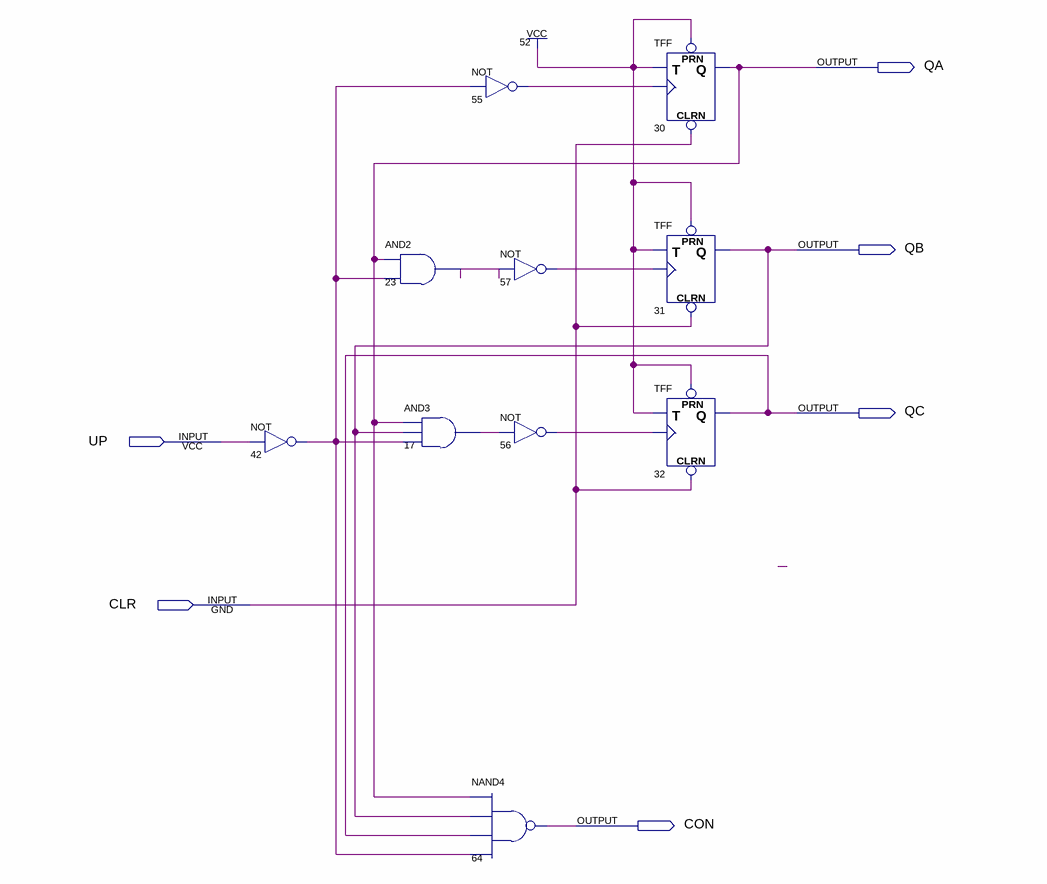
[diagram p0: schematic sheet]
// Quartus schematic count8new10sept.bdf as structural Verilog: 10 symbols, 6 pins
module count8new10sept (
  input  UP,
  input  CLR,
  output QA,
  output QB,
  output QC,
  output CON
);

  wire n17_out, n23_out, n42_out, n55_out, n56_out, n57_out;

  not u_42 (n42_out, UP);
  and u_23 (n23_out, QA, n42_out);
  and u_17 (n17_out, QA, QB, n42_out);
  not u_55 (n55_out, n42_out);
  not u_57 (n57_out, n23_out);
  not u_56 (n56_out, n17_out);
  nand u_64 (CON, QA, QB, QC, n42_out);
  TFF u_30 (.PRN(1'b1), .CLRN(CLR), .T(1'b1), .CLK(n55_out), .Q(QA));
  TFF u_31 (.PRN(1'b1), .CLRN(CLR), .T(1'b1), .CLK(n57_out), .Q(QB));
  TFF u_32 (.PRN(1'b1), .CLRN(CLR), .T(1'b1), .CLK(n56_out), .Q(QC));
endmodule
